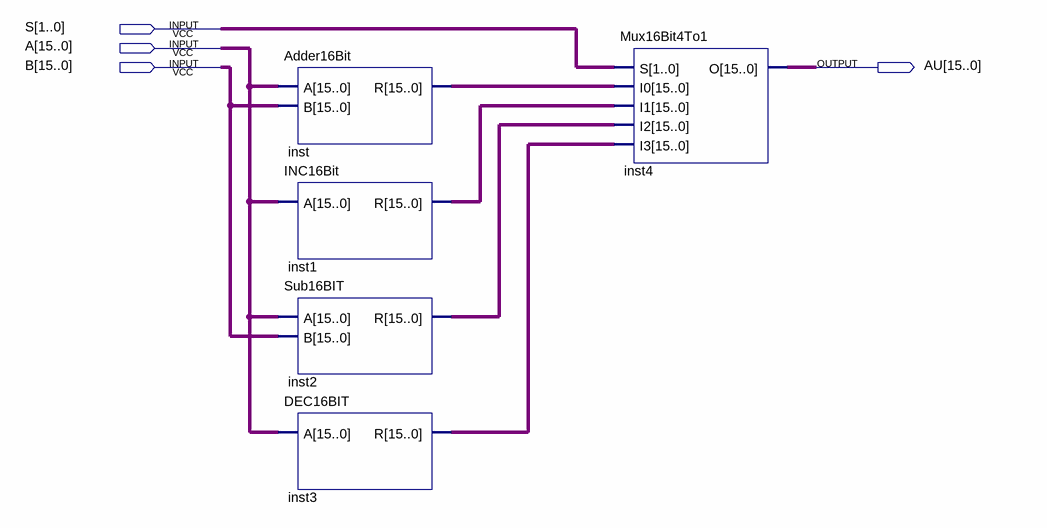
[diagram p0: schematic sheet]
// Quartus schematic AU.bdf as structural Verilog: 5 symbols, 4 pins
module AU (
  input  [1:0] S,
  input  [15:0] A,
  input  [15:0] B,
  output [15:0] AU
);

  wire [15:0] inst1_r, inst2_r, inst3_r, inst_r;

  Adder16Bit inst (.A(A), .B(B), .R(inst_r));
  INC16Bit inst1 (.A(A), .R(inst1_r));
  Sub16BIT inst2 (.A(A), .B(B), .R(inst2_r));
  DEC16BIT inst3 (.A(A), .R(inst3_r));
  Mux16Bit4To1 inst4 (.S(S), .I0(inst_r), .I1(inst1_r), .I2(inst2_r), .I3(inst3_r), .O(AU));
endmodule
